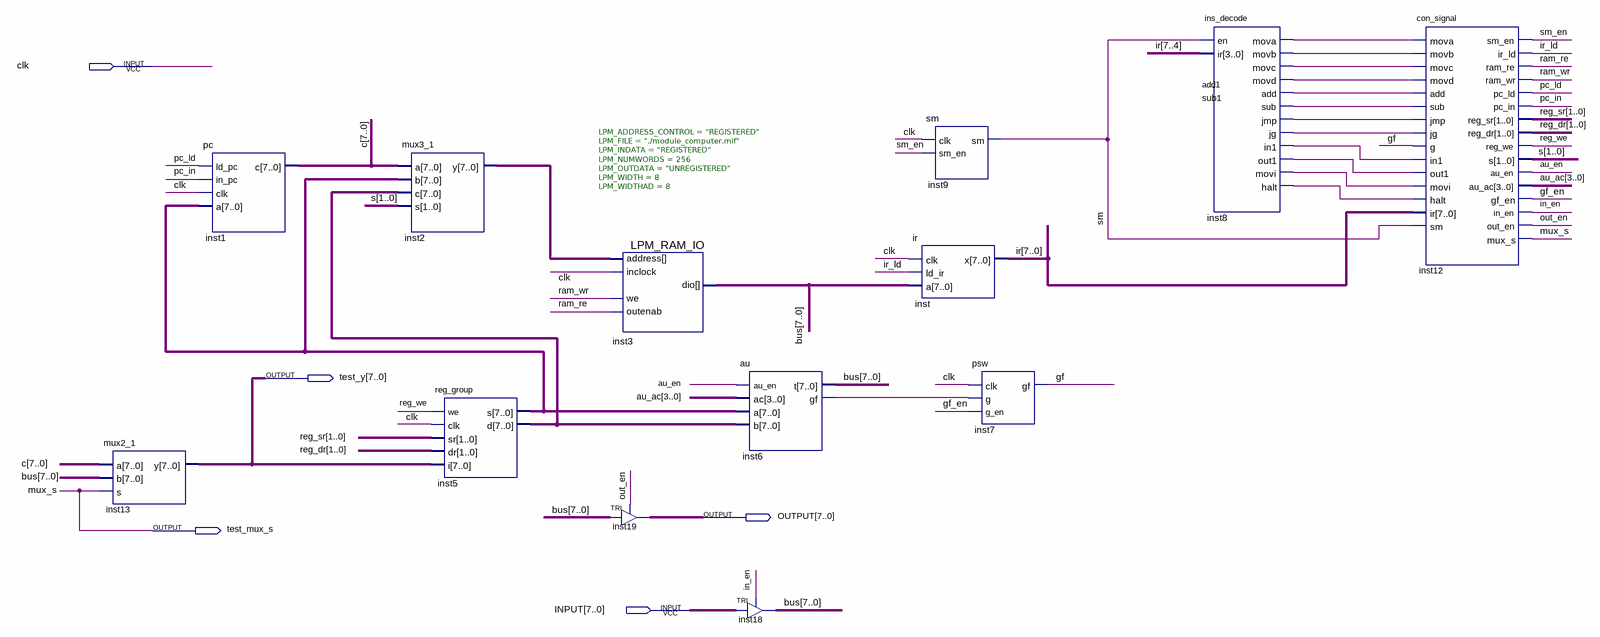
[diagram p0: schematic sheet]
// Quartus schematic module_computer.bdf as structural Verilog: 13 symbols, 5 pins
module module_computer (
  input  clk,
  input  [7:0] INPUT,
  output [7:0] test_y,
  output [7:0] OUTPUT,
  output test_mux_s
);

  wire add1, au_en, gf, gf_en, in_en, inst6_gf, inst8_halt, inst8_in1, inst8_jg, inst8_jmp, inst8_mova,
       inst8_movb, inst8_movc, inst8_movd, inst8_movi, inst8_out1, ir_ld, out_en, pc_in, pc_ld, ram_re,
       ram_wr, reg_we, sm, sm_en, sub1;
  wire [1:0] reg_dr, reg_sr, s;
  wire [3:0] au_ac;
  wire [7:0] bus, c, inst2_y, inst5_d, inst5_s, ir;

  mux2_1 inst13 (.a(c), .b(bus), .s(test_mux_s), .y(test_y));
  pc inst1 (.ld_pc(pc_ld), .in_pc(pc_in), .clk(clk), .a(inst5_s), .c(c));
  mux3_1 inst2 (.a(c), .b(inst5_s), .c(inst5_d), .s(s), .y(inst2_y));
  reg_group inst5 (.we(reg_we), .clk(clk), .sr(reg_sr), .dr(reg_dr), .i(test_y), .s(inst5_s), .d(inst5_d));
  LPM_RAM_IO #(.LPM_ADDRESS_CONTROL("REGISTERED"), .LPM_FILE("./module_computer.mif"), .LPM_INDATA("REGISTERED"), .LPM_NUMWORDS(256), .LPM_OUTDATA("UNREGISTERED"), .LPM_WIDTH(8), .LPM_WIDTHAD(8)) inst3 (
    .address(inst2_y), .inclock(clk), .we(ram_wr), .outenab(ram_re), .dio(bus));
  TRI inst19[7:0] (.IN(bus), .OE(out_en), .OUT(OUTPUT));
  au inst6 (.au_en(au_en), .ac(au_ac), .a(inst5_s), .b(inst5_d), .t(bus), .gf(inst6_gf));
  TRI inst18[7:0] (.IN(INPUT), .OE(in_en), .OUT(bus));
  sm inst9 (.clk(clk), .sm_en(sm_en), .sm(sm));
  ir inst (.clk(clk), .ld_ir(ir_ld), .a(bus), .x(ir));
  psw inst7 (.clk(clk), .g(inst6_gf), .g_en(gf_en), .gf(gf));
  ins_decode inst8 (
    .en(sm), .ir(ir[7:4]), .mova(inst8_mova), .movb(inst8_movb), .movc(inst8_movc), .movd(inst8_movd),
    .add(add1), .sub(sub1), .jmp(inst8_jmp), .jg(inst8_jg), .in1(inst8_in1), .out1(inst8_out1),
    .movi(inst8_movi), .halt(inst8_halt));
  con_signal inst12 (
    .mova(inst8_mova), .movb(inst8_movb), .movc(inst8_movc), .movd(inst8_movd), .add(add1), .sub(sub1),
    .jmp(inst8_jmp), .jg(inst8_jg), .g(gf), .in1(inst8_in1), .out1(inst8_out1), .movi(inst8_movi),
    .halt(inst8_halt), .ir(ir), .sm(sm), .sm_en(sm_en), .ir_ld(ir_ld), .ram_re(ram_re), .ram_wr(ram_wr),
    .pc_ld(pc_ld), .pc_in(pc_in), .reg_sr(reg_sr), .reg_dr(reg_dr), .reg_we(reg_we), .s(s), .au_en(au_en),
    .au_ac(au_ac), .gf_en(gf_en), .in_en(in_en), .out_en(out_en), .mux_s(test_mux_s));

  // Other names for the same wires on the sheet: mux_s = test_mux_s
endmodule
